# Altium project Controller_root.PrjPcb
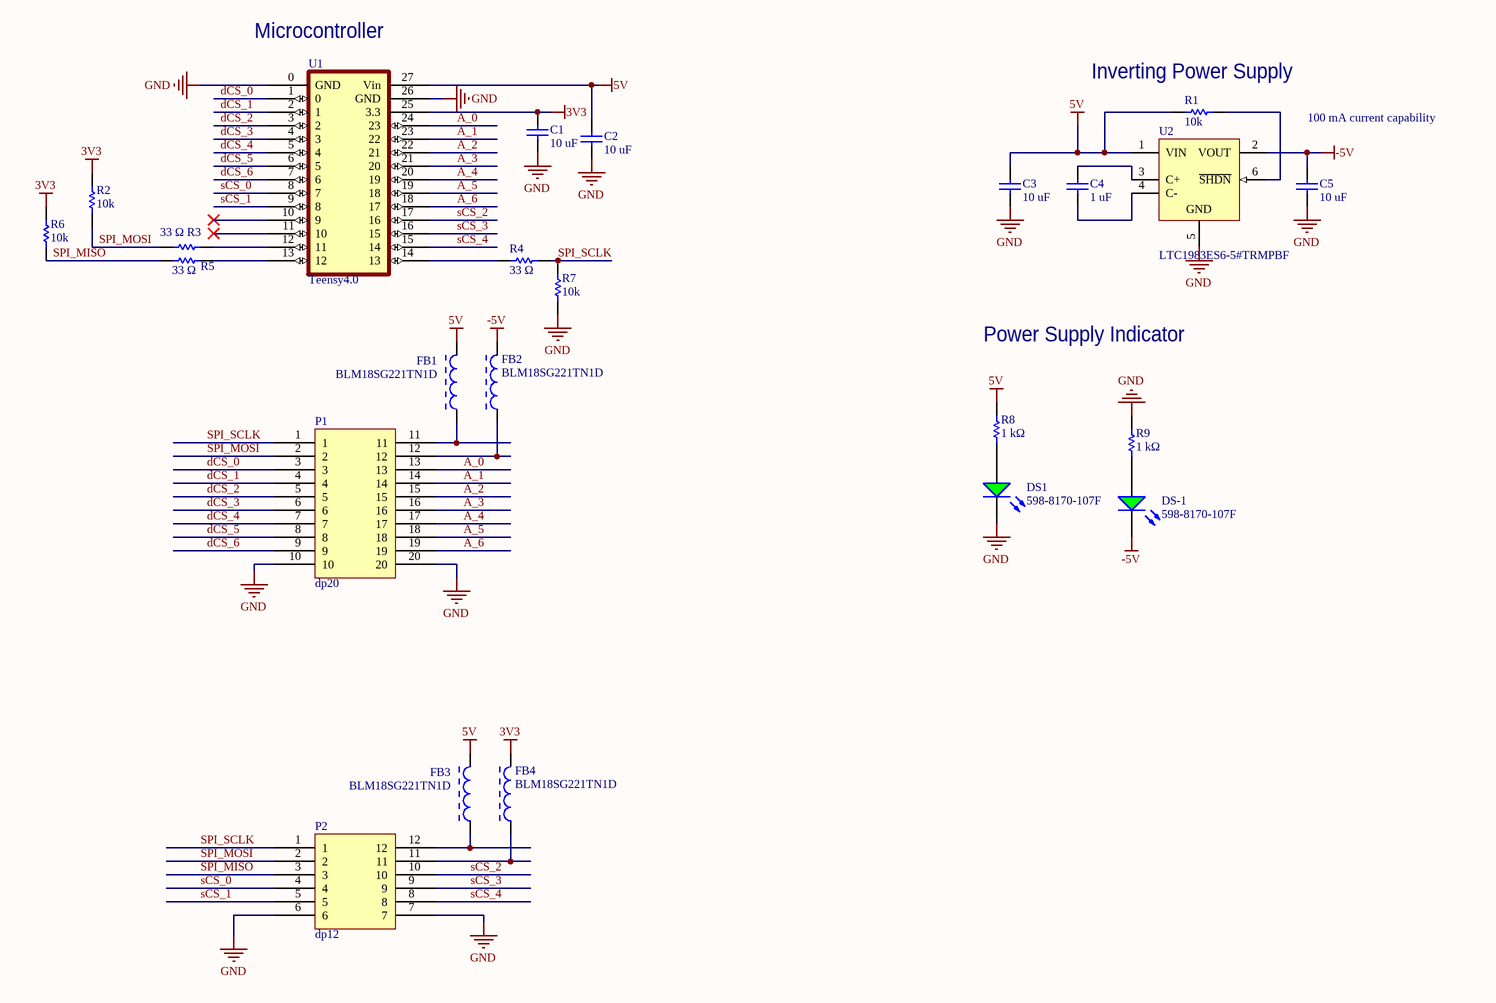
[diagram p0: Controller_root.SchDoc]
1 sheet, 24 parts. Net scope: global (net labels, ports and power ports of the same name join across sheets).
Board file: Controller_Root.PcbDoc

## Sheet Controller_root.SchDoc: Controller_root
size Tabloid; Author: Nicholas Belsten; DrawnBy: Nicholas Belsten; DocumentNumber: 1; Revision: A; SheetNumber: 1; SheetTotal: 1; ProgramName: Helmholtz Cage

### Parts
C1  10 uF  [CAPC1608X90X20ML10]
C2  10 uF  [CAPC1608X90X20ML10]
C3  10 uF  [CAPC1608X90X20ML10]
C4  1 uF  [CAPC1608X90X20ML10]
C5  10 uF  [CAPC1608X90X20ML10]
DS1  598-8170-107F  [DIAL-0805-2_V]
DS-1  598-8170-107F  [DIAL-0805-2_V]
FB1  BLM18SG221TN1D  [MURA-BLM18SG-B25-CHIP-2_V1]
FB2  BLM18SG221TN1D  [MURA-BLM18SG-B25-CHIP-2_V1]
FB3  BLM18SG221TN1D  [MURA-BLM18SG-B25-CHIP-2_V1]
FB4  BLM18SG221TN1D  [MURA-BLM18SG-B25-CHIP-2_V1]
P1  dp20  [dp20-900]
P2  dp12  [dp12-900]
R1  10k  [RESC1609X55X30ML15T15]
R2  10k  [RESC1609X55X30ML15T15]
R3  33 Ω  [RESC1609X50X30NL10T20]
R4  33 Ω  [RESC1609X50X30NL10T20]
R5  33 Ω  [RESC1609X50X30NL10T20]
R6  10k  [RESC1609X55X30ML15T15]
R7  10k  [RESC1609X55X30ML15T15]
R8  1 kΩ  [RESC1608X55X30LL15T15]
R9  1 kΩ  [RESC1608X55X30LL15T15]
U1  Teensy4.0  [DIP28-600]
U2  LTC1983ES6-5#TRMPBF  [LT-S6-6-TSOT-23_N]

### Nets
3V3: C1.2 FB4.2 R2.2 R6.1 U1.25(3.3)
5V: C2.2 C3.2 FB1.2 FB3.2 R1.1 R8.2 U1.27(Vin) U2.1(VIN)
-5V: C5.2 DS-1.2(K) FB2.2 U2.2(VOUT)
GND: C1.1 C2.1 C3.1 C5.1 DS1.2(K) P1.10 P1.20 P2.6 P2.7 R7.1 R9.2 U1.0(GND) U1.26(GND) U2.5(GND)
A_0: P1.13 U1.24(23)
A_1: P1.14 U1.23(22)
A_2: P1.15 U1.22(21)
A_3: P1.16 U1.21(20)
A_4: P1.17 U1.20(19)
A_5: P1.18 U1.19(18)
A_6: P1.19 U1.18(17)
dCS_0: P1.3 U1.1(0)
dCS_1: P1.4 U1.2(1)
dCS_2: P1.5 U1.3(2)
dCS_3: P1.6 U1.4(3)
dCS_4: P1.7 U1.5(4)
dCS_5: P1.8 U1.6(5)
dCS_6: P1.9 U1.7(6)
sCS_0: P2.4 U1.8(7)
sCS_1: P2.5 U1.9(8)
sCS_2: P2.10 U1.17(16)
sCS_3: P2.9 U1.16(15)
sCS_4: P2.8 U1.15(14)
SPI_MISO: P2.3 R5.1 R6.2
SPI_MOSI: P1.2 P2.2 R2.1 R3.1
SPI_SCLK: P1.1 P2.1 R4.2 R7.2
NetC4_1: C4.1 U2.4(C-)
NetC4_2: C4.2 U2.3(C+)
NetDS1_1: DS1.1(A) R8.1
NetDS-1_1: DS-1.1(A) R9.1
NetFB1_1: FB1.1 P1.11
NetFB2_1: FB2.1 P1.12
NetFB3_1: FB3.1 P2.12
NetFB4_1: FB4.1 P2.11
NetR1_2: R1.2 U2.6(~{SHDN})
NetR3_2: R3.2 U1.12(11)
NetR4_1: R4.1 U1.14(13)
NetR5_2: R5.2 U1.13(12)

Not connected (* = marked no-connect by the designer): U1 10(9)* 11(10)*

### Notes on the sheet
- (near U1) Microcontroller
- (near R1) Inverting Power Supply
- 100 mA current capability
- Power Supply Indicator
- Title
- Size
- Date
- Tabloid
- DCN
- Time
- Sheet
- of
- Revision
- Drawn
- 33-207 / 77 Mass. Ave.
- Cambridge, MA 02139
- File

### Library data of the parts
C1-C3 C5 = CMP-2000-04979-1: Chip Capacitor, 10 uF, +/- 10%, 10 V, -55 to 85 degC, 0603 (1608 Metric), RoHS, Tape and Reel; PCN Part Number: MLCCPartNumberChange30/Nov/2012; Manufacturer: TDK; Temperature Coefficient: X5R; Product Training Modules: CSeriesGeneralApplicationsSEAT,CCV,andTVCLDesignToolsGuidetoReplacinganElectrolyticCapacitorwithanMLCC; Online Catalog: CSeries,GeneralPurpose; Voltage - Rated: 10V; Other Names: 445-7486-1; Capacitance: 10µF; Design Resources: 20WNon-IsolatedBuckLEDDriverUsingPLLNK460KG; Kits: 445-9003-KIT-ND-KITCAPCERHICAPMLCCSMD; Height - Seated (Max): -; Family: CeramicCapacitors; Package Description: 2-Pin Surface Mount Device, Body 1.6 x 0.8 mm; Category: Capacitors; Datasheet Version: Mar-15; RoHS Information: RoHSCertificate-MLCC; Thickness (Max): 0.035"(0.90mm); Operating Temperature: -55degC~85degC; Package Reference: 603; Series: C; Applications: GeneralPurpose; Datasheet URL: http://download.siliconexpert.com/pdfs/2015/4/21/15/54/45/779/tdk_/manual/37024850441143360mlcc_commercial_general_en.pdf; Features: -; Lead Style: -; Lead Spacing: -; Ratings: -; Size / Dimension: 0.063"Lx0.031"W(1.60mmx0.80mm); Tolerance: ±10%; Mounting Type: SurfaceMount,MLCC; Standard Package: 1; Package / Case: 0603(1608Metric); Manufacturer URL: http://www.tdk.com/; Packaging: CutTape(CT)
C4 = CMP-2000-06025-1: Chip Capacitor, 1 uF, +/- 10%, 50 V, -55 to 85 degC, 0603 (1608 Metric), RoHS, Tape and Reel; Manufacturer: TDK; PCN Part Number: MLCCPartNumberChange30/Nov/2012; Other Names: 445-7468-6; Online Catalog: CSeries,GeneralPurpose; Capacitance: 1µF; Product Training Modules: CSeriesGeneralApplicationsSEAT,CCV,andTVCLDesignToolsGuidetoReplacinganElectrolyticCapacitorwithanMLCC; Voltage - Rated: 50V; Design Resources: 20WNon-IsolatedBuckLEDDriverUsingPLLNK460KG; Temperature Coefficient: X5R; Series: C; Datasheet Version: 08/2016; Package Description: 2-Pin Surface Mount Device, Body 1.6 x 0.8 mm; Mounting Technology: SurfaceMount; Features: -; Size / Dimension: 0.063"Lx0.031"W(1.60mmx0.80mm); Lead Spacing: -; Operating Temperature: -55°C~85°C; Tolerance: ±10%; Height - Seated (Max): -; Mounting Type: SurfaceMount,MLCC; Ratings: -; Standard Package: 1; Applications: GeneralPurpose; Datasheet URL: https://product.tdk.com/info/en/catalog/datasheets/mlcc_commercial_general_en.pdf; Category: Capacitors; Lead Style: -; Packaging: Digi-Reel®; RoHS Information: RoHSCertificate-MLCC; Package / Case: 0603(1608Metric); Package Reference: 0603; Manufacturer URL: http://www.tdk.com/; Thickness (Max): 0.035"(0.90mm); Family: CeramicCapacitors
DS1 = CMP-2000-05655-1: Single Color, 2 V, -30 to 85 degC, 2-Pin SMD (0805), RoHS, Tape and Reel; Manufacturer: Dialight; Main Category: ChipLED; Shape Type: Rectangular; Forward Current: 25mA; Product Length (mm): 2mm; Emitting Color: YellowGreen; Test Current (It): 20mA; Number of  Elements: 1; Luminous Intensity: 20mcd; DELETED: Compliant; Reverse Voltage: 5V; Chip Material: GaP; High Brightness: No; Viewing Angle: 140deg; Dominant Wave Length: 570nm; Type: Uni-Color; Product Depth (mm): 1.25mm; Power Dissipation: 60W; Product Height (mm): 0.7mm; Forward Voltage: 2.4V; Lens Dimensions: 1.4x1.25x0.4mm; Pin Count: 2; Datasheet URL: https://datasheet.ciiva.com/22748/1484480-22748121.pdf; Operating Temperature Classification: Commercial; Package Reference: 0805; Operating Temp Range: -30Cto85C; Mounting: SurfaceMount; Mounting Technology: SurfaceMount; Manufacturer URL: http://www.dialight.com/; Package Description: 2-Pin Surface Mount Device, Body 2 x 1.25 mm; Lum Intensity: 20mcd; Datasheet Version: 10/2008; Rad Hardened: No; Packaging: TapeandReel; Package Type: SMD
DS-1 = CMP-2000-05655-1: Single Color, 2 V, -30 to 85 degC, 2-Pin SMD (0805), RoHS, Tape and Reel; Manufacturer: Dialight; Main Category: ChipLED; Shape Type: Rectangular; Forward Current: 25mA; Product Length (mm): 2mm; Emitting Color: YellowGreen; Test Current (It): 20mA; Number of  Elements: 1; Luminous Intensity: 20mcd; DELETED: Compliant; Reverse Voltage: 5V; Chip Material: GaP; High Brightness: No; Viewing Angle: 140deg; Dominant Wave Length: 570nm; Product Depth (mm): 1.25mm; Power Dissipation: 60W; Product Height (mm): 0.7mm; Forward Voltage: 2.4V; Lens Dimensions: 1.4x1.25x0.4mm; Pin Count: 2; Datasheet URL: https://datasheet.ciiva.com/22748/1484480-22748121.pdf; Operating Temperature Classification: Commercial; Package Reference: 0805; Operating Temp Range: -30Cto85C; Mounting: SurfaceMount; Mounting Technology: SurfaceMount; Manufacturer URL: http://www.dialight.com/; Package Description: 2-Pin Surface Mount Device, Body 2 x 1.25 mm; Type: Uni-Color; Lum Intensity: 20mcd; Datasheet Version: 10/2008; Rad Hardened: No; Packaging: TapeandReel; Package Type: SMD
FB1-FB4 = CMP-0686-00596-2: Chip Ferrite Bead for Power Lines (Low DC Resistance Type), 220 Ohm, 2500 mA, -55 to 125 degC, 1.6 x 0.8 x 0.65 mm SMD, Tape and Reel; Manufacturer: Murata; Impedance (at 100 MHz): 220 Ohm +/- 25%; DC Resistance: 0.040 Ohm Max.; Rated Current: 2500 mA; ComponentLink2Description: Datasheet; ComponentLink1Description: Manufacturer URL; ComponentLink3Description: Package Specification; DatasheetVersion: 08/2013; Packing: Tape and Reel; PackageReference: BLM18_H650-2; PackageDescription: 2-Pin Chip, Body 1.6 x 0.8 mm; Mounting Technology: Surface Mount; Operating Temperature Range: -55 to 125 degC; ComponentLink1URL: http://www.murata.com/; ComponentLink2URL: http://www.murata.com/products/catalog/pdf/c31e.pdf; ComponentLink3URL: http://www.murata.com/products/catalog/pdf/c31e.pdf; PartNumber: BLM18SG221TN1D
R1 R2 R6 R7 = CMP-2000-07452-1: Chip Resistor, 10 KOhm, +/- 1%, 0.1 W, -55 to 155 degC, 0603 (1608 Metric), RoHS, Tape and Reel; Manufacturer: Panasonic; Voltage Rating: 75V; Case\/Package: 0603; Power Rating: 100mW; Resistance: 10KOhm; Temperature Coefficient: 100ppm\/degreesC; Number of Pins: 2; Package Reference: 603; Depth: 0.8mm; Mount: SurfaceMount; Package Description: 2-Pin Surface Mount Device, Body 1.6 x 0.85 mm; Datasheet Version: 02/2017; Length: 1.6mm; Lead Free: LeadFree; Height: 0.45mm; Number of Terminations: 2; Max Power Dissipation: 100mW; Min Operating Temperature: -55degC; Datasheet URL: https://industrial.panasonic.com/cdbs/www-data/pdf/RDA0000/AOA0000C304.pdf; Termination: SMD/SMT; Case Code (Metric): 1608; Case Code (Imperial): 0603; Tolerance: 1%; Max Operating Temperature: 155degC; RoHSCompliant: true; Voltage Rating (DC): 75V; Radiation Hardening: No; Packaging: TapeandReel; Composition: ThickFilm; Mounting Technology: SurfaceMount; Manufacturer URL: http://www.panasonic.com/; Width: 0.031inch; REACH SVHC: NoSVHC; Contact Plating: Tin; Military Standard: Not; Package Quantity: 1
R3-R5 = CMP-2000-03250-1: Part Number: CRCW060333R0FKEA; Manufacturer: Vishay Dale; Resistance: 33 Ω
R8 R9 = CMP-2000-00180-1: Part Number: ERJ-3EKF1001V; Manufacturer: Panasonic; Resistance: 1 kΩ
U1 = Teensy4.0: pin to pad: 0>1 1>2 2>3 3>4 4>5 5>6 6>7 7>8 8>9 9>10 10>11 11>12 12>13 13>14 14>15 15>16 16>17 17>18 18>19 19>20 20>21 21>22 22>23 23>24 24>25 25>26 26>27 27>28
U2 = CMP-0475-00352-1: 100 mA Regulated Charge-Pump Inverter, 5 to 5.5 V Vin, -5 V Vout, 6-pin SOT23 (S6-6), -40 to 85 degC, Pb-Free, Mini Tape and Reel; Manufacturer: Linear Technology; Frequency(kHz): 900; Vin Max(V): 5.5; Isupply(mA): 0.025; Ishutdown(uA): 0.1; Max Iout(mA): 100; Voutput: -5 V; Vin Min(V): 5; ComponentLink3URL: http://cds.linear.com/docs/en/packaging/SOT_6_05-08-1636.pdf; RoHS: TRUE; ComponentLink1URL: http://www.linear.com/; PackageVersion: Jun-10; ComponentLink1Description: Manufacturer URL; PackageDescription: 6-Pin Plastic TSOT-23, Body 2.9 x 1.63 mm, Pitch 0.95 mm; DatasheetVersion: Rev. A; Code_JEDEC: MO-193; ComponentLink2Description: Datasheet; PartNumber: LTC1983ES6-5#TRMPBF; PackageReference: S6-6; ComponentLink2URL: http://cds.linear.com/docs/en/datasheet/1983fa.pdf; Packing: Mini Tape and Reel; Mounting Technology: Surface Mount; ComponentLink3Description: Package Specification